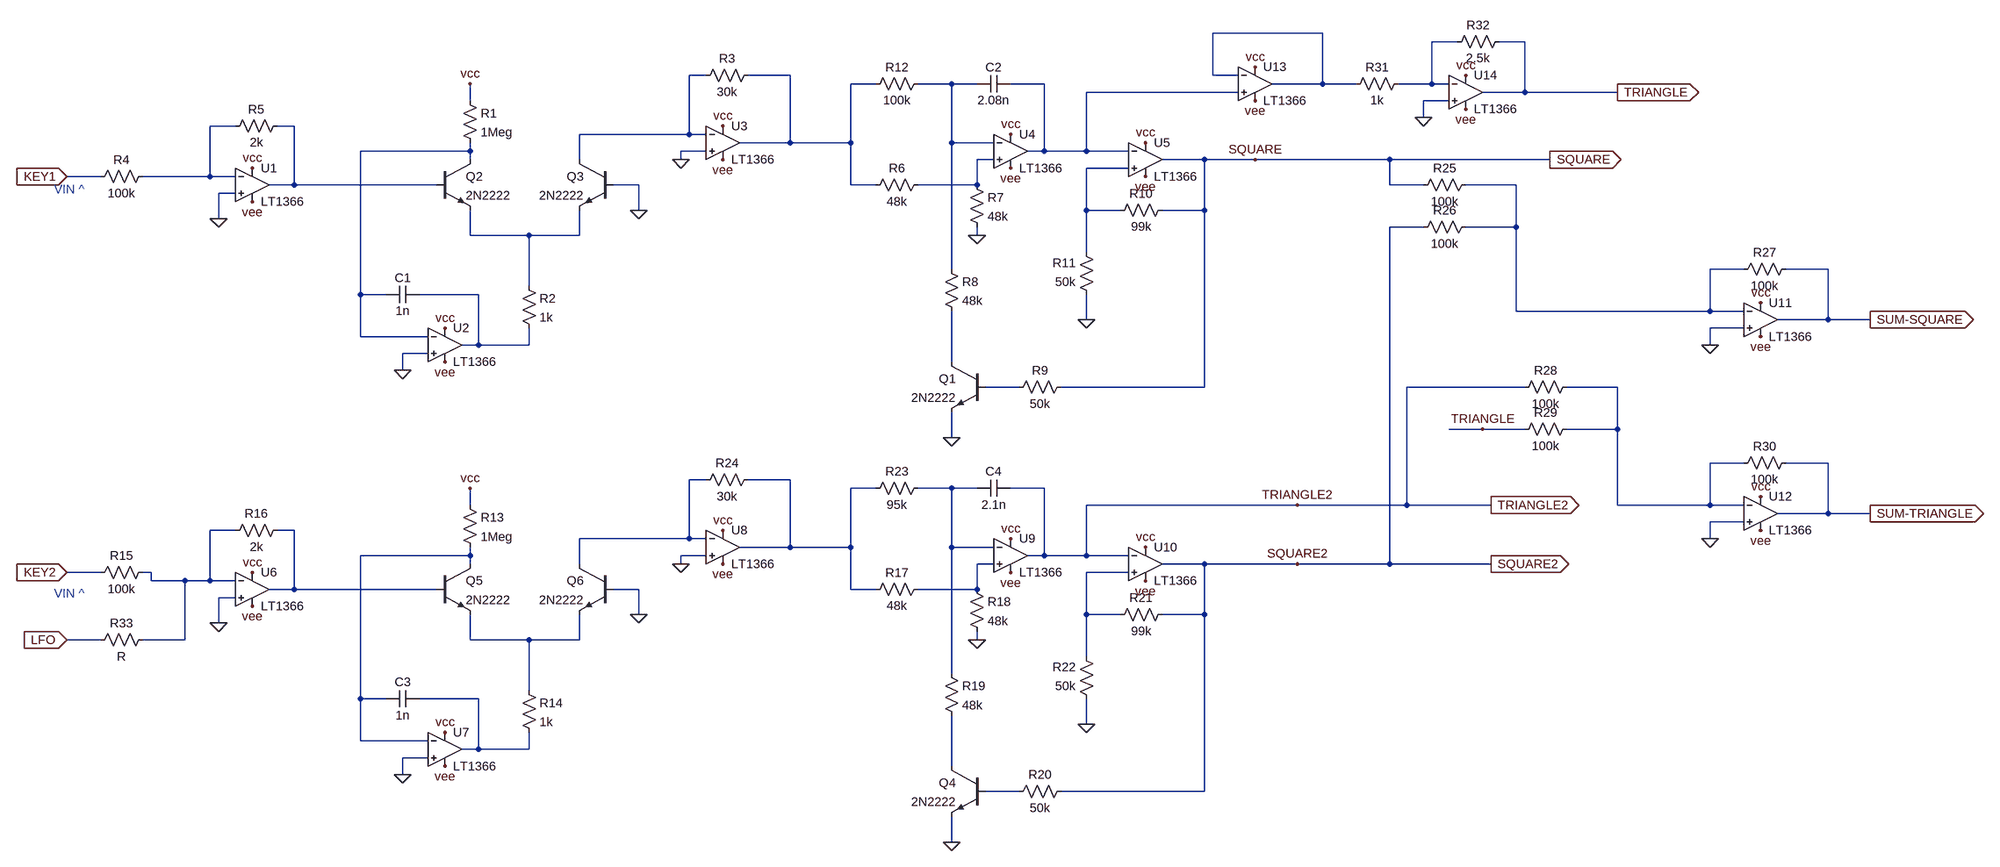
[diagram p0: schematic Draft36.asc]
Draft36.asc, the LTspice schematic file:
Version 4
SHEET 1 2352 864
WIRE 1104 -688 896 -688
WIRE 1360 -672 1312 -672
WIRE 1488 -672 1440 -672
WIRE -208 -608 -240 -608
WIRE -48 -608 -128 -608
WIRE 896 -608 896 -688
WIRE 944 -608 896 -608
WIRE 256 -592 208 -592
WIRE 400 -592 336 -592
WIRE 448 -592 400 -592
WIRE 576 -592 512 -592
WIRE 1104 -592 1104 -688
WIRE 1104 -592 1008 -592
WIRE 1168 -592 1104 -592
WIRE 1312 -592 1312 -672
WIRE 1312 -592 1248 -592
WIRE 1344 -592 1312 -592
WIRE 944 -576 656 -576
WIRE 1488 -576 1488 -672
WIRE 1488 -576 1408 -576
WIRE 1664 -576 1488 -576
WIRE -656 -560 -656 -592
WIRE 1344 -560 1296 -560
WIRE 1296 -528 1296 -560
WIRE -1200 -512 -1248 -512
WIRE -1088 -512 -1120 -512
WIRE -240 -496 -240 -608
WIRE -240 -496 -448 -496
WIRE -208 -496 -240 -496
WIRE -48 -480 -48 -608
WIRE -48 -480 -144 -480
WIRE 208 -480 208 -592
WIRE 208 -480 -48 -480
WIRE 400 -480 400 -592
WIRE 480 -480 400 -480
WIRE -656 -464 -656 -480
WIRE -656 -464 -864 -464
WIRE -208 -464 -256 -464
WIRE 576 -464 576 -592
WIRE 576 -464 544 -464
WIRE 656 -464 656 -576
WIRE 656 -464 576 -464
WIRE 736 -464 656 -464
WIRE -656 -448 -656 -464
WIRE -448 -448 -448 -496
WIRE -256 -448 -256 -464
WIRE 480 -448 448 -448
WIRE 880 -448 800 -448
WIRE 976 -448 880 -448
WIRE 1232 -448 976 -448
WIRE 1536 -448 1232 -448
WIRE 736 -432 656 -432
WIRE -1456 -416 -1520 -416
WIRE -1248 -416 -1248 -512
WIRE -1248 -416 -1376 -416
WIRE -1200 -416 -1248 -416
WIRE -1088 -400 -1088 -512
WIRE -1088 -400 -1136 -400
WIRE -720 -400 -1088 -400
WIRE -336 -400 -384 -400
WIRE 208 -400 208 -480
WIRE 256 -400 208 -400
WIRE 448 -400 448 -448
WIRE 448 -400 336 -400
WIRE 1232 -400 1232 -448
WIRE 1296 -400 1232 -400
WIRE 1472 -400 1376 -400
WIRE -1200 -384 -1232 -384
WIRE -336 -352 -336 -400
WIRE 656 -352 656 -432
WIRE 720 -352 656 -352
WIRE 880 -352 880 -448
WIRE 880 -352 800 -352
WIRE -1232 -336 -1232 -384
WIRE 1296 -320 1232 -320
WIRE 1472 -320 1472 -400
WIRE 1472 -320 1376 -320
WIRE -656 -304 -656 -352
WIRE -544 -304 -656 -304
WIRE -448 -304 -448 -352
WIRE -448 -304 -544 -304
WIRE 448 -304 448 -320
WIRE 656 -272 656 -352
WIRE 400 -240 400 -480
WIRE 1904 -240 1840 -240
WIRE 2064 -240 1984 -240
WIRE -544 -208 -544 -304
WIRE -864 -192 -864 -464
WIRE -816 -192 -864 -192
WIRE -640 -192 -752 -192
WIRE 1472 -160 1472 -320
WIRE 1840 -160 1840 -240
WIRE 1840 -160 1472 -160
WIRE 1904 -160 1840 -160
WIRE 656 -144 656 -192
WIRE 2064 -144 2064 -240
WIRE 2064 -144 1968 -144
WIRE 2144 -144 2064 -144
WIRE 1904 -128 1840 -128
WIRE -864 -112 -864 -192
WIRE -736 -112 -864 -112
WIRE -640 -96 -640 -192
WIRE -640 -96 -672 -96
WIRE -544 -96 -544 -128
WIRE -544 -96 -640 -96
WIRE 1840 -96 1840 -128
WIRE -736 -80 -784 -80
WIRE 400 -64 400 -160
WIRE -784 -48 -784 -80
WIRE 528 -16 464 -16
WIRE 880 -16 880 -352
WIRE 880 -16 608 -16
WIRE 1488 -16 1264 -16
WIRE 1664 -16 1568 -16
WIRE 1408 64 1344 64
WIRE 1488 64 1408 64
WIRE 1664 64 1664 -16
WIRE 1664 64 1568 64
WIRE 400 80 400 32
WIRE 1904 128 1840 128
WIRE 2064 128 1984 128
WIRE -208 160 -240 160
WIRE -48 160 -128 160
WIRE 256 176 208 176
WIRE 400 176 336 176
WIRE 448 176 400 176
WIRE 576 176 512 176
WIRE -656 208 -656 176
WIRE 1056 208 656 208
WIRE 1264 208 1264 -16
WIRE 1264 208 1056 208
WIRE 1424 208 1264 208
WIRE 1664 208 1664 64
WIRE 1840 208 1840 128
WIRE 1840 208 1664 208
WIRE 1904 208 1840 208
WIRE 2064 224 2064 128
WIRE 2064 224 1968 224
WIRE 2144 224 2064 224
WIRE 1904 240 1840 240
WIRE -1200 256 -1248 256
WIRE -1088 256 -1120 256
WIRE -240 272 -240 160
WIRE -240 272 -448 272
WIRE -208 272 -240 272
WIRE 1840 272 1840 240
WIRE -48 288 -48 160
WIRE -48 288 -144 288
WIRE 208 288 208 176
WIRE 208 288 -48 288
WIRE 400 288 400 176
WIRE 480 288 400 288
WIRE -656 304 -656 288
WIRE -656 304 -864 304
WIRE -208 304 -256 304
WIRE 576 304 576 176
WIRE 576 304 544 304
WIRE 656 304 656 208
WIRE 656 304 576 304
WIRE 736 304 656 304
WIRE -656 320 -656 304
WIRE -448 320 -448 272
WIRE -256 320 -256 304
WIRE 480 320 448 320
WIRE 880 320 800 320
WIRE 1056 320 880 320
WIRE 1232 320 1232 -320
WIRE 1232 320 1056 320
WIRE 1424 320 1232 320
WIRE -1456 336 -1520 336
WIRE -1360 336 -1376 336
WIRE 736 336 656 336
WIRE -1360 352 -1360 336
WIRE -1296 352 -1360 352
WIRE -1248 352 -1248 256
WIRE -1248 352 -1296 352
WIRE -1200 352 -1248 352
WIRE -1088 368 -1088 256
WIRE -1088 368 -1136 368
WIRE -720 368 -1088 368
WIRE -336 368 -384 368
WIRE 208 368 208 288
WIRE 256 368 208 368
WIRE 448 368 448 320
WIRE 448 368 336 368
WIRE -1200 384 -1232 384
WIRE -336 416 -336 368
WIRE 656 416 656 336
WIRE 720 416 656 416
WIRE 880 416 880 320
WIRE 880 416 800 416
WIRE -1232 432 -1232 384
WIRE -1456 464 -1520 464
WIRE -1296 464 -1296 352
WIRE -1296 464 -1376 464
WIRE -656 464 -656 416
WIRE -544 464 -656 464
WIRE -448 464 -448 416
WIRE -448 464 -544 464
WIRE 448 464 448 448
WIRE 656 496 656 416
WIRE 400 528 400 288
WIRE -544 560 -544 464
WIRE -864 576 -864 304
WIRE -816 576 -864 576
WIRE -640 576 -752 576
WIRE 656 624 656 576
WIRE -864 656 -864 576
WIRE -736 656 -864 656
WIRE -640 672 -640 576
WIRE -640 672 -672 672
WIRE -544 672 -544 640
WIRE -544 672 -640 672
WIRE -736 688 -784 688
WIRE 400 704 400 608
WIRE -784 720 -784 688
WIRE 528 752 464 752
WIRE 880 752 880 416
WIRE 880 752 608 752
WIRE 400 848 400 800
FLAG -336 -352 0
FLAG -656 -592 vcc
FLAG -784 -48 0
FLAG -256 -448 0
FLAG -176 -512 vcc
FLAG -176 -448 vee
FLAG -704 -128 vcc
FLAG -704 -64 vee
FLAG -1168 -432 vcc
FLAG -1232 -336 0
FLAG -1520 -416 KEY1
IOPIN -1520 -416 In
FLAG 512 -496 vcc
FLAG 768 -480 vcc
FLAG 1664 -576 TRIANGLE
IOPIN 1664 -576 Out
FLAG 448 -304 0
FLAG 400 80 0
FLAG 656 -144 0
FLAG 768 -416 vee
FLAG 512 -432 vee
FLAG -1168 -368 vee
FLAG -336 416 0
FLAG -656 176 vcc
FLAG -784 720 0
FLAG -256 320 0
FLAG -176 256 vcc
FLAG -176 320 vee
FLAG -704 640 vcc
FLAG -704 704 vee
FLAG -1168 336 vcc
FLAG -1232 432 0
FLAG -1520 336 KEY2
IOPIN -1520 336 In
FLAG 512 272 vcc
FLAG 768 288 vcc
FLAG 1056 208 TRIANGLE2
FLAG 448 464 0
FLAG 400 848 0
FLAG 656 624 0
FLAG 768 352 vee
FLAG 512 336 vee
FLAG -1168 400 vee
FLAG 1840 -96 0
FLAG 1936 -176 vcc
FLAG 1936 -112 vee
FLAG 2144 -144 SUM-SQUARE
IOPIN 2144 -144 Out
FLAG 1840 272 0
FLAG 1936 192 vcc
FLAG 1936 256 vee
FLAG 2144 224 SUM-TRIANGLE
IOPIN 2144 224 Out
FLAG 976 -448 SQUARE
FLAG 1056 320 SQUARE2
FLAG 976 -624 vcc
FLAG 976 -560 vee
FLAG 1296 -528 0
FLAG 1376 -608 vcc
FLAG 1376 -544 vee
FLAG 1408 64 TRIANGLE
FLAG 1536 -448 SQUARE
IOPIN 1536 -448 Out
FLAG 1424 208 TRIANGLE2
IOPIN 1424 208 Out
FLAG 1424 320 SQUARE2
IOPIN 1424 320 Out
FLAG -1520 464 LFO
IOPIN -1520 464 In
SYMBOL res -672 -576 R0
SYMATTR InstName R1
SYMATTR Value 1Meg
SYMBOL cap -752 -208 R90
WINDOW 0 0 32 VBottom 2
WINDOW 3 32 32 VTop 2
SYMATTR InstName C1
SYMATTR Value 1n
SYMBOL res -560 -224 R0
SYMATTR InstName R2
SYMATTR Value 1k
SYMBOL res -112 -624 R90
WINDOW 0 0 56 VBottom 2
WINDOW 3 32 56 VTop 2
SYMATTR InstName R3
SYMATTR Value 30k
SYMBOL res -1360 -432 R90
WINDOW 0 0 56 VBottom 2
WINDOW 3 32 56 VTop 2
SYMATTR InstName R4
SYMATTR Value 100k
SYMBOL res -1104 -528 R90
WINDOW 0 0 56 VBottom 2
WINDOW 3 32 56 VTop 2
SYMATTR InstName R5
SYMATTR Value 2k
SYMBOL cap 512 -608 R90
WINDOW 0 0 32 VBottom 2
WINDOW 3 32 32 VTop 2
SYMATTR InstName C2
SYMATTR Value 2.08n
SYMBOL res 352 -416 R90
WINDOW 0 0 56 VBottom 2
WINDOW 3 32 56 VTop 2
SYMATTR InstName R6
SYMATTR Value 48k
SYMBOL res 432 -416 R0
SYMATTR InstName R7
SYMATTR Value 48k
SYMBOL res 384 -256 R0
SYMATTR InstName R8
SYMATTR Value 48k
SYMBOL npn 464 -64 M0
SYMATTR InstName Q1
SYMATTR Value 2N2222
SYMBOL res 624 -32 R90
WINDOW 0 0 56 VBottom 2
WINDOW 3 32 56 VTop 2
SYMATTR InstName R9
SYMATTR Value 50k
SYMBOL res 816 -368 R90
WINDOW 0 0 56 VBottom 2
WINDOW 3 32 56 VTop 2
SYMATTR InstName R10
SYMATTR Value 99k
SYMBOL res 672 -176 R180
WINDOW 0 36 76 Left 2
WINDOW 3 36 40 Left 2
SYMATTR InstName R11
SYMATTR Value 50k
SYMBOL res 352 -608 R90
WINDOW 0 0 56 VBottom 2
WINDOW 3 32 56 VTop 2
SYMATTR InstName R12
SYMATTR Value 100k
SYMBOL npn -720 -448 R0
SYMATTR InstName Q2
SYMATTR Value 2N2222
SYMBOL npn -384 -448 M0
SYMATTR InstName Q3
SYMATTR Value 2N2222
SYMBOL LT1366 -1168 -464 R0
SYMATTR InstName U1
SYMBOL LT1366 -704 -160 R0
SYMATTR InstName U2
SYMBOL LT1366 -176 -544 R0
SYMATTR InstName U3
SYMBOL LT1366 512 -528 R0
SYMATTR InstName U4
SYMBOL LT1366 768 -512 R0
SYMATTR InstName U5
SYMBOL res -672 192 R0
SYMATTR InstName R13
SYMATTR Value 1Meg
SYMBOL cap -752 560 R90
WINDOW 0 0 32 VBottom 2
WINDOW 3 32 32 VTop 2
SYMATTR InstName C3
SYMATTR Value 1n
SYMBOL res -560 544 R0
SYMATTR InstName R14
SYMATTR Value 1k
SYMBOL res -1360 320 R90
WINDOW 0 0 56 VBottom 2
WINDOW 3 32 56 VTop 2
SYMATTR InstName R15
SYMATTR Value 100k
SYMBOL res -1104 240 R90
WINDOW 0 0 56 VBottom 2
WINDOW 3 32 56 VTop 2
SYMATTR InstName R16
SYMATTR Value 2k
SYMBOL cap 512 160 R90
WINDOW 0 0 32 VBottom 2
WINDOW 3 32 32 VTop 2
SYMATTR InstName C4
SYMATTR Value 2.1n
SYMBOL res 352 352 R90
WINDOW 0 0 56 VBottom 2
WINDOW 3 32 56 VTop 2
SYMATTR InstName R17
SYMATTR Value 48k
SYMBOL res 432 352 R0
SYMATTR InstName R18
SYMATTR Value 48k
SYMBOL res 384 512 R0
SYMATTR InstName R19
SYMATTR Value 48k
SYMBOL npn 464 704 M0
SYMATTR InstName Q4
SYMATTR Value 2N2222
SYMBOL res 624 736 R90
WINDOW 0 0 56 VBottom 2
WINDOW 3 32 56 VTop 2
SYMATTR InstName R20
SYMATTR Value 50k
SYMBOL res 816 400 R90
WINDOW 0 0 56 VBottom 2
WINDOW 3 32 56 VTop 2
SYMATTR InstName R21
SYMATTR Value 99k
SYMBOL res 672 592 R180
WINDOW 0 36 76 Left 2
WINDOW 3 36 40 Left 2
SYMATTR InstName R22
SYMATTR Value 50k
SYMBOL res 352 160 R90
WINDOW 0 0 56 VBottom 2
WINDOW 3 32 56 VTop 2
SYMATTR InstName R23
SYMATTR Value 95k
SYMBOL npn -720 320 R0
SYMATTR InstName Q5
SYMATTR Value 2N2222
SYMBOL npn -384 320 M0
SYMATTR InstName Q6
SYMATTR Value 2N2222
SYMBOL LT1366 -1168 304 R0
SYMATTR InstName U6
SYMBOL LT1366 -704 608 R0
SYMATTR InstName U7
SYMBOL LT1366 -176 224 R0
SYMATTR InstName U8
SYMBOL LT1366 512 240 R0
SYMATTR InstName U9
SYMBOL LT1366 768 256 R0
SYMATTR InstName U10
SYMBOL res -112 144 R90
WINDOW 0 0 56 VBottom 2
WINDOW 3 32 56 VTop 2
SYMATTR InstName R24
SYMATTR Value 30k
SYMBOL LT1366 1936 -208 R0
SYMATTR InstName U11
SYMBOL res 1392 -416 R90
WINDOW 0 0 56 VBottom 2
WINDOW 3 32 56 VTop 2
SYMATTR InstName R25
SYMATTR Value 100k
SYMBOL res 1392 -336 R90
WINDOW 0 0 56 VBottom 2
WINDOW 3 32 56 VTop 2
SYMATTR InstName R26
SYMATTR Value 100k
SYMBOL res 2000 -256 R90
WINDOW 0 0 56 VBottom 2
WINDOW 3 32 56 VTop 2
SYMATTR InstName R27
SYMATTR Value 100k
SYMBOL LT1366 1936 160 R0
SYMATTR InstName U12
SYMBOL res 1584 -32 R90
WINDOW 0 0 56 VBottom 2
WINDOW 3 32 56 VTop 2
SYMATTR InstName R28
SYMATTR Value 100k
SYMBOL res 1584 48 R90
WINDOW 0 0 56 VBottom 2
WINDOW 3 32 56 VTop 2
SYMATTR InstName R29
SYMATTR Value 100k
SYMBOL res 2000 112 R90
WINDOW 0 0 56 VBottom 2
WINDOW 3 32 56 VTop 2
SYMATTR InstName R30
SYMATTR Value 100k
SYMBOL LT1366 976 -656 R0
SYMATTR InstName U13
SYMBOL LT1366 1376 -640 R0
SYMATTR InstName U14
SYMBOL res 1264 -608 R90
WINDOW 0 0 56 VBottom 2
WINDOW 3 32 56 VTop 2
SYMATTR InstName R31
SYMATTR Value 1k
SYMBOL res 1456 -688 R90
WINDOW 0 0 56 VBottom 2
WINDOW 3 32 56 VTop 2
SYMATTR InstName R32
SYMATTR Value 2.5k
SYMBOL res -1360 448 R90
WINDOW 0 0 56 VBottom 2
WINDOW 3 32 56 VTop 2
SYMATTR InstName R33
TEXT -1544 -392 Left 2 ;VIN ^
TEXT -1544 376 Left 2 ;VIN ^

The netlist it stands for:
* Draft36.asc
R1 vcc N009 1Meg
C1 N014 N009 1n
R2 N013 N014 1k
R3 N004 N003 30k
R4 N007 KEY1 100k
R5 N008 N007 2k
C2 N006 N005 2.08n
R6 N010 N004 48k
R7 N010 0 48k
R8 N005 N015 48k
Q1 N015 N016 0 0 2N2222
R9 SQUARE N016 50k
R10 SQUARE N011 99k
R11 0 N011 50k
R12 N005 N004 100k
Q2 N009 N008 N013 0 2N2222
Q3 N003 0 N013 0 2N2222
XU1 0 N007 vcc vee N008 LT1366  ; pins In+ In- V+ V- OUT
XU2 0 N009 vcc vee N014 LT1366  ; pins In+ In- V+ V- OUT
XU3 0 N003 vcc vee N004 LT1366  ; pins In+ In- V+ V- OUT
XU4 N010 N005 vcc vee N006 LT1366  ; pins In+ In- V+ V- OUT
XU5 N011 N006 vcc vee SQUARE LT1366  ; pins In+ In- V+ V- OUT
R13 vcc N023 1Meg
C3 N027 N023 1n
R14 N026 N027 1k
R15 N021 KEY2 100k
R16 N022 N021 2k
C4 TRIANGLE2 N020 2.1n
R17 N024 N019 48k
R18 N024 0 48k
R19 N020 N028 48k
Q4 N028 N029 0 0 2N2222
R20 SQUARE2 N029 50k
R21 SQUARE2 N025 99k
R22 0 N025 50k
R23 N020 N019 95k
Q5 N023 N022 N026 0 2N2222
Q6 N018 0 N026 0 2N2222
XU6 0 N021 vcc vee N022 LT1366  ; pins In+ In- V+ V- OUT
XU7 0 N023 vcc vee N027 LT1366  ; pins In+ In- V+ V- OUT
XU8 0 N018 vcc vee N019 LT1366  ; pins In+ In- V+ V- OUT
XU9 N024 N020 vcc vee TRIANGLE2 LT1366  ; pins In+ In- V+ V- OUT
XU10 N025 TRIANGLE2 vcc vee SQUARE2 LT1366  ; pins In+ In- V+ V- OUT
R24 N019 N018 30k
XU11 0 N012 vcc vee SUM-SQUARE LT1366  ; pins In+ In- V+ V- OUT
R25 N012 SQUARE 100k
R26 N012 SQUARE2 100k
R27 SUM-SQUARE N012 100k
XU12 0 N017 vcc vee SUM-TRIANGLE LT1366  ; pins In+ In- V+ V- OUT
R28 N017 TRIANGLE2 100k
R29 N017 TRIANGLE 100k
R30 SUM-TRIANGLE N017 100k
XU13 N006 N001 vcc vee N001 LT1366  ; pins In+ In- V+ V- OUT
XU14 0 N002 vcc vee TRIANGLE LT1366  ; pins In+ In- V+ V- OUT
R31 N002 N001 1k
R32 TRIANGLE N002 2.5k
R33 N021 LFO R
.model NPN NPN
.model PNP PNP
.lib standard.bjt
* VIN ^
* VIN ^
.lib LTC.lib
.backanno
.end